# Altium schematic sheet mcu.SchDoc
size A4
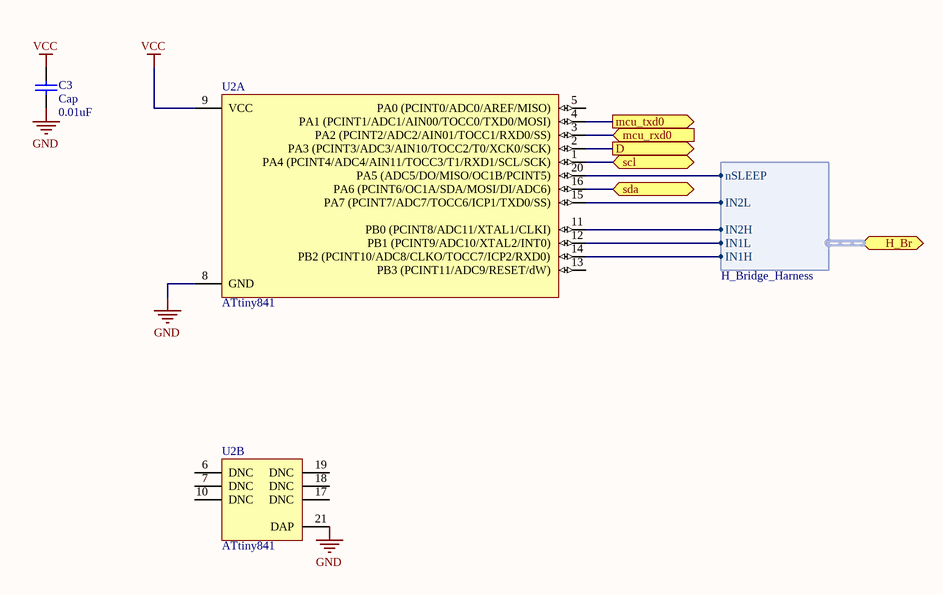
[diagram p0: mcu.SchDoc]

## Parts
C3  Cap  value 0.01uF  [RAD-0.3]
U2  ATtiny841  [20M1_L]  (parts A,B of 2)

## Ports
D (out), H_Br (harness H_Bridge_Harness), mcu_rxd0 (in), mcu_txd0 (out), scl (bidir), sda (bidir)

## Harnesses
H_Bridge_Harness: IN1H, IN1L, IN2H, IN2L, nSLEEP

## Nets
GND: C3.1 U2.8(GND) U2.21(DAP)
VCC: C3.2 U2.9(VCC)
D: U2.2(PA3_(PCINT3/ADC3/AIN10/TOCC2/T0/XCK0/SCK)) ; port D
mcu_rxd0: U2.3(PA2_(PCINT2/ADC2/AIN01/TOCC1/RXD0/SS)) ; port mcu_rxd0
mcu_txd0: U2.4(PA1_(PCINT1/ADC1/AIN00/TOCC0/TXD0/MOSI)) ; port mcu_txd0
scl: U2.1(PA4_(PCINT4/ADC4/AIN11/TOCC3/T1/RXD1/SCL/SCK)) ; port scl
sda: U2.16(PA6_(PCINT6/OC1A/SDA/MOSI/DI/ADC6)) ; port sda
NetU2_11: U2.11(PB0_(PCINT8/ADC11/XTAL1/CLKI)) ; port H_Br.IN2H
NetU2_12: U2.12(PB1_(PCINT9/ADC10/XTAL2/INT0)) ; port H_Br.IN1L
NetU2_14: U2.14(PB2_(PCINT10/ADC8/CLKO/TOCC7/ICP2/RXD0)) ; port H_Br.IN1H
NetU2_15: U2.15(PA7_(PCINT7/ADC7/TOCC6/ICP1/TXD0/SS)) ; port H_Br.IN2L
NetU2_20: U2.20(PA5_(ADC5/DO/MISO/OC1B/PCINT5)) ; port H_Br.nSLEEP

Not connected (* = marked no-connect by the designer): U2 5(PA0_(PCINT0/ADC0/AREF/MISO)) 6(DNC) 7(DNC) 10(DNC) 13(PB3_(PCINT11/ADC9/RESET/dW)) 17(DNC) 18(DNC) 19(DNC)

## Library data of the parts
C3 = Cap: Capacitor; Published: 8-Jun-2000; LatestRevisionDate: 17-Jul-2002; LatestRevisionNote: Re-released for DXP Platform.; PackageReference: RAD-0.3; Publisher: Altium Limited; PackageDescription: Radial Cap, Thru-Hole; 2 Leads; 0.3 in Pin Spacing
U2 = ATtiny841: 8-bit AVR Microcontroller with 4/8K Bytes In-System  Programmable Flash; DatasheetVersion: revK, Oct-2010; PackageVersion: revA, Oct-2004; PackageReference: 20M1; PackageDescription: 20-pad, 4 x 4 x 0.8 mm Body, Lead Pitch 0.50 mm, 2.6 mm Exposed Pad, Micro Lead Frame Package (MLF); Code_JEDEC: MO-220WGGD-5; ComponentLink1Description: Manufacturer URL; ComponentLink1URL: http://www.atmel.com/; ComponentLink2Description: ATtiny24/44/84 Datasheet; ComponentLink2URL: http://www.atmel.com/Images/Atmel-8495-8-bit-AVR-Microcontrollers-ATtiny441-ATtiny841_Datasheet.pdf; ComponentLink3Description: ATtiny24/44/84 Summary; ComponentLink3URL: http://www.atmel.com/dyn/resources/prod_documents/8006S.pdf